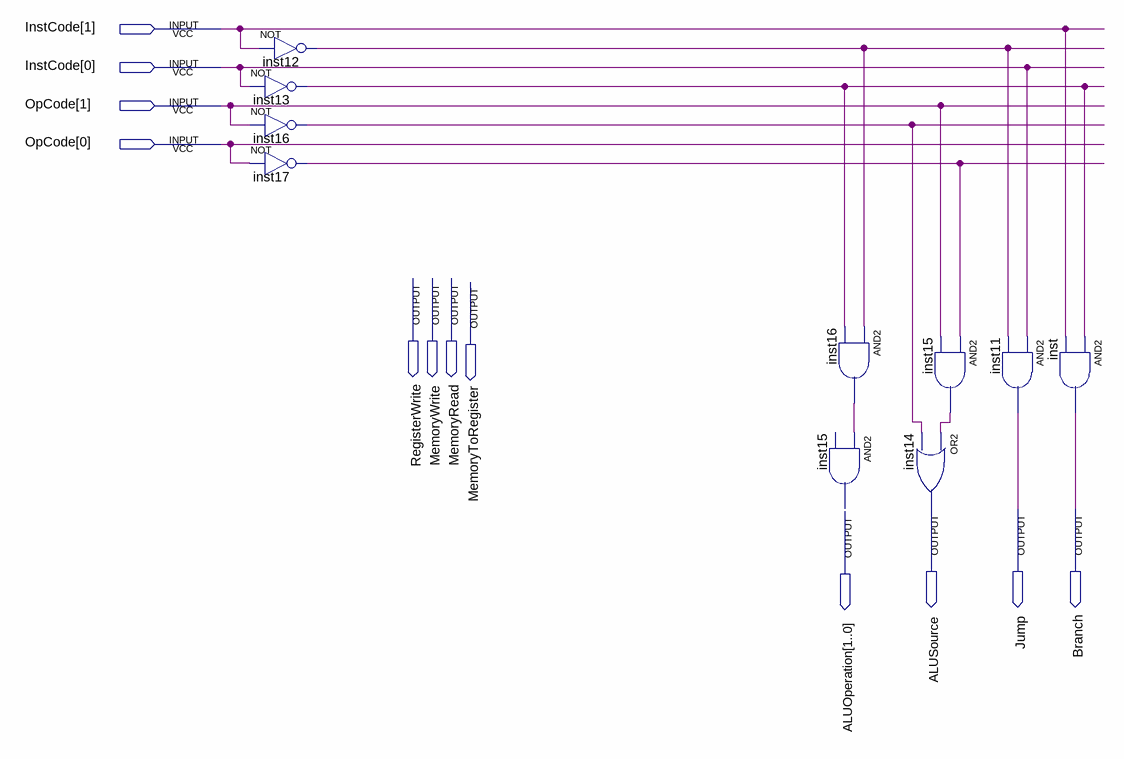
[diagram p0: schematic sheet]
// Quartus schematic Control.bdf as structural Verilog: 10 symbols, 12 pins
module Control (
  input  [1:0] InstCode,
  input  [1:0] OpCode,
  output RegisterWrite,
  output MemoryWrite,
  output MemoryRead,
  output MemoryToRegister,
  output [1:0] ALUOperation,
  output ALUSource,
  output Jump,
  output Branch
);

  wire inst12_out, inst13_out, inst15_out, inst16_out, inst16_out_2, inst17_out;

  not inst12 (inst12_out, InstCode[1]);
  not inst13 (inst13_out, InstCode[0]);
  not inst16 (inst16_out, OpCode[1]);
  not inst17 (inst17_out, OpCode[0]);
  and inst16_dup2 (inst16_out_2, inst12_out, inst13_out);
  assign ALUOperation = {2{inst16_out_2}};  // AND2 inst15, 2 bits wide AND2 open: IN2
  or inst14 (ALUSource, inst15_out, inst16_out);
  and inst15_dup2 (inst15_out, inst17_out, OpCode[1]);
  and inst (Branch, inst13_out, InstCode[1]);
  and inst11 (Jump, InstCode[0], inst12_out);
endmodule
